# Altium schematic sheet MB_clocking.SchDoc
size A
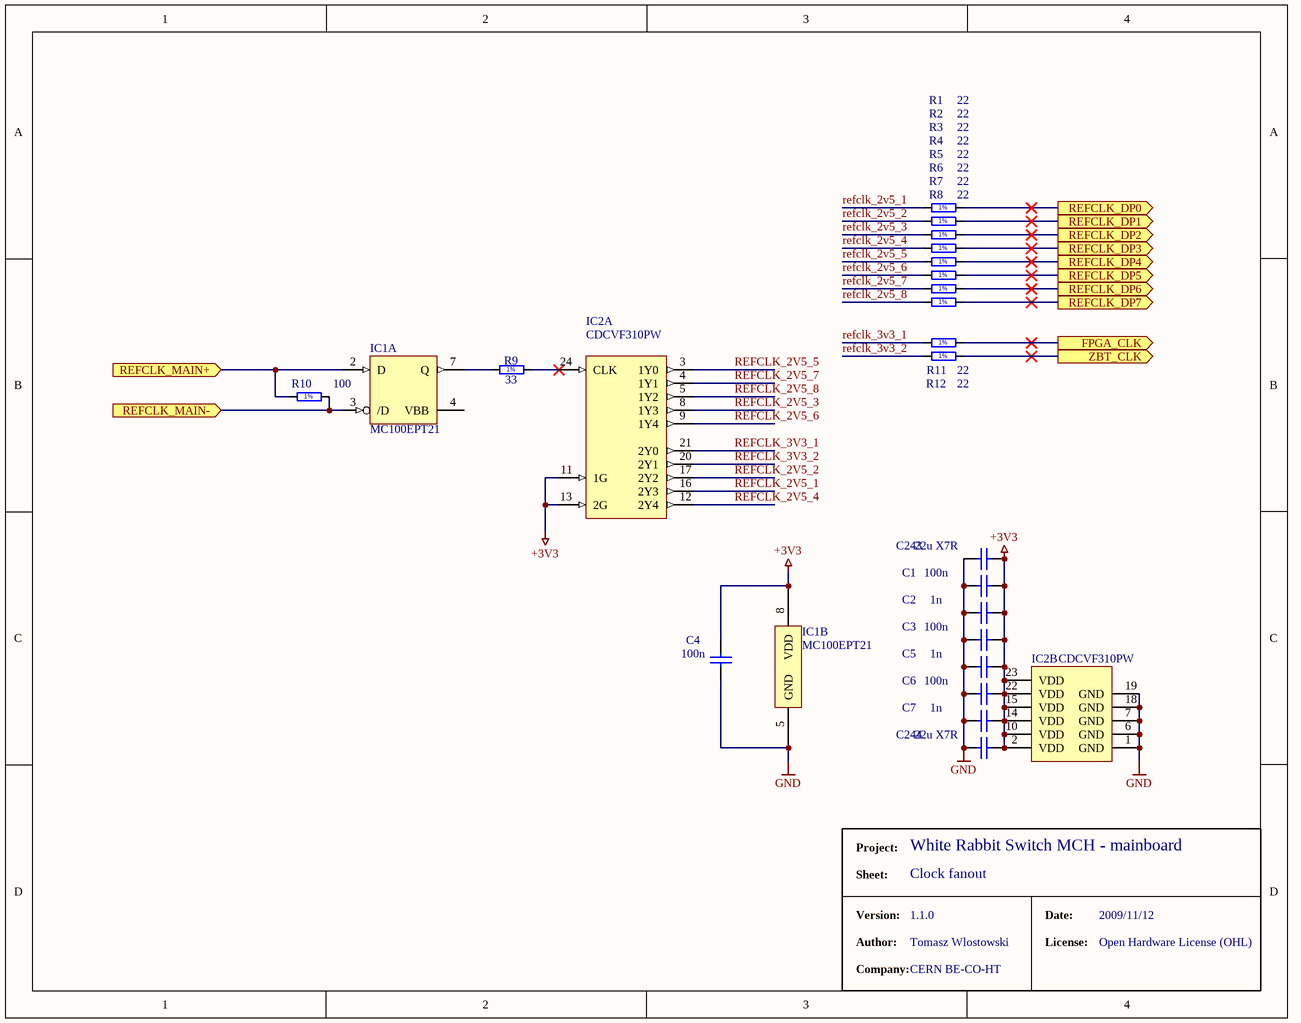
[diagram p0: MB_clocking.SchDoc]

## Parts
C1  100n  [CAPC1005X55N]
C2  1n  [CAPC1005X55N]
C3  100n  [CAPC1005X55N]
C4  100n  [CAPC1005X55N]
C5  1n  [CAPC1005X55N]
C6  100n  [CAPC1005X55N]
C7  1n  [CAPC1005X55N]
C243  22u X7R  [CAPC2012X135N]
C244  22u X7R  [CAPC2012X135N]
IC1  MC100EPT21  [TSOP65P490-8AN]  (parts A,B of 2)
IC2  CDCVF310PW  [TSOP65P640-24AL]  (parts A,B of 2)
R1  22  [RESC1005X40N]
R2  22  [RESC1005X40N]
R3  22  [RESC1005X40N]
R4  22  [RESC1005X40N]
R5  22  [RESC1005X40N]
R6  22  [RESC1005X40N]
R7  22  [RESC1005X40N]
R8  22  [RESC1005X40N]
R9  33  [RESC1005X40N]
R10  100  [RESC1005X40N]
R11  22  [RESC1005X40N]
R12  22  [RESC1005X40N]

## Ports
FPGA_CLK (out), REFCLK_DP0 (out), REFCLK_DP1 (out), REFCLK_DP2 (out), REFCLK_DP3 (out), REFCLK_DP4 (out), REFCLK_DP5 (out), REFCLK_DP6 (out), REFCLK_DP7 (out), REFCLK_MAIN+ (in), REFCLK_MAIN- (in), ZBT_CLK (out)

## Nets
+3V3: C1.1 C2.2 C3.1 C4.2 C5.2 C6.1 C7.2 C243.1 C244.1 IC1.8(VDD) IC2.2(VDD) IC2.10(VDD) IC2.11(1G) IC2.13(2G) IC2.14(VDD) IC2.15(VDD) IC2.22(VDD) IC2.23(VDD)
GND: C1.2 C2.1 C3.2 C4.1 C5.1 C6.2 C7.1 C243.2 C244.2 IC1.5(GND) IC2.1(GND) IC2.6(GND) IC2.7(GND) IC2.18(GND) IC2.19(GND)
FPGA_CLK: R11.2 ; port FPGA_CLK
refclk_2v5_1: IC2.16(2Y3) R1.1
refclk_2v5_2: IC2.17(2Y2) R2.1
refclk_2v5_3: IC2.8(1Y3) R3.1
refclk_2v5_4: IC2.12(2Y4) R4.1
refclk_2v5_5: IC2.3(1Y0) R5.1
refclk_2v5_6: IC2.9(1Y4) R6.1
refclk_2v5_7: IC2.4(1Y1) R7.1
refclk_2v5_8: IC2.5(1Y2) R8.1
refclk_3v3_1: IC2.21(2Y0) R11.1
refclk_3v3_2: IC2.20(2Y1) R12.1
REFCLK_DP0: R1.2 ; port REFCLK_DP0
REFCLK_DP1: R2.2 ; port REFCLK_DP1
REFCLK_DP2: R3.2 ; port REFCLK_DP2
REFCLK_DP3: R4.2 ; port REFCLK_DP3
REFCLK_DP4: R5.2 ; port REFCLK_DP4
REFCLK_DP5: R6.2 ; port REFCLK_DP5
REFCLK_DP6: R7.2 ; port REFCLK_DP6
REFCLK_DP7: R8.2 ; port REFCLK_DP7
REFCLK_MAIN+: IC1.2(D) R10.1 ; port REFCLK_MAIN+
REFCLK_MAIN-: IC1.3(/D) R10.2 ; port REFCLK_MAIN-
ZBT_CLK: R12.2 ; port ZBT_CLK
NetIC1_7: IC1.7(Q) R9.1
NetIC2_24: IC2.24(CLK) R9.2

Not connected (* = marked no-connect by the designer): IC1 4(VBB)

## Notes on the sheet
- Project:
- Sheet:
- Clock fanout
- White Rabbit Switch MCH - mainboard
- Version:
- Author:
- Company:
- 1.1.0
- Tomasz Wlostowski
- CERN BE-CO-HT
- Date:
- License:
- 2009/11/12
- Open Hardware License (OHL)
- (in symbol R0402_22R_1%_0.0625W_100PPM) 1%
- (in symbol R0402_33R_1%_0.0625W_100PPM) 1%
- (in symbol R0402_100R_1%_0.0625W_100PPM) 1%

## Library data of the parts
C1 C3 C4 C6 = CC0402_100NF_16V_10%_X7R: Non-polarised capacitor; Part Description: SMD Multilayer Chip Ceramic Capacitor; Manufacturer: GENERIC; Manufacturer1 Part Number: 223878715649; Manufacturer1 Datasheet: \\cern.ch\dfs\Applications\Altium\Datasheets\CC0402_X7R_PHYCOMP.pdf; Value: 100nF; Voltage: 16V; TC: X7R; Tolerance: ±10%; Table: Capacitors SMD; Part Number: CC0402_100NF_16V_10%_X7R; Component Kind: Standard; Component Type: Standard; Designator: Capacitor - non polarized; Library Reference: Capacitor - non polarized; Pin Count: 2; Status: Not Recommended; Manufacturer Part Number: CC0402_100NF_16V_10%_X7R; Case: 0402; Mounted: Yes; Socket: No; SMD: Yes; Manufacturer1 Example: PHYCOMP; Manufacturer1 ComponentHeight: 0.55mm; HelpURL: \\cern.ch\dfs\Applications\Altium\Datasheets\CC0402_X7R_PHYCOMP.pdf; Author: CERN DEM JLC; CreateDate: 12/3/2007; LatestRevisionDate: 12/3/2007
C2 C5 C7 = CC0402_1NF_50V_10%_X7R: Non-polarised capacitor; Part Description: SMD Multilayer Chip Ceramic Capacitor; Manufacturer: GENERIC; Manufacturer1 Part Number: 223858715623; Manufacturer1 Datasheet: \\cern.ch\dfs\Applications\Altium\Datasheets\CC0402_X7R_PHYCOMP.pdf; Value: 1nF; Voltage: 50V; TC: X7R; Tolerance: ±10%; Table: Capacitors SMD; Part Number: CC0402_1NF_50V_10%_X7R; Component Kind: Standard; Component Type: Standard; Designator: Capacitor - non polarized; Library Reference: Capacitor - non polarized; Pin Count: 2; Status: Not Recommended; Manufacturer Part Number: CC0402_1NF_50V_10%_X7R; Case: 0402; Mounted: Yes; Socket: No; SMD: Yes; Manufacturer1 Example: PHYCOMP; Manufacturer1 ComponentHeight: 0.55mm; HelpURL: \\cern.ch\dfs\Applications\Altium\Datasheets\CC0402_X7R_PHYCOMP.pdf; Author: CERN DEM JLC; CreateDate: 2007-12-03; LatestRevisionDate: 2007-12-03
C243 C244 = CC0805_22uF_6.3V_20%_X5R: Non-polarised capacitor; Part Description: SMD Multilayer Chip Ceramic Capacitor; Manufacturer: GENERIC; Manufacturer1 Part Number: C0805C226M9PAC7800; Manufacturer1 Datasheet: \\cern.ch\dfs\Applications\Altium\Datasheets\CC1206_X5R_KEMET.pdf; Value: 22uF; Voltage: 6.3V; TC: X5R; Tolerance: ±20%; Table: Capacitors SMD; Part Number: CC0805_22uF_6.3V_20%_X5R; Component Kind: Standard; Component Type: Standard; Designator: Capacitor - non polarized; Library Reference: Capacitor - non polarized; Pin Count: 2; Status: Preferred; Manufacturer Part Number: CC0805_22uF_6.3V_20%_X5R; Case: 0805; Mounted: Yes; Socket: No; SMD: Yes; Manufacturer1 Example: KEMET; Manufacturer1 ComponentHeight: 1.45mm; HelpURL: \\cern.ch\dfs\Applications\Altium\Datasheets\CC1206_X5R_KEMET.pdf; Author: CERN DEM JLC; CreateDate: 12/3/2007; LatestRevisionDate: 12/3/2007
IC1 = MC100EPT21: ONSemi LVDS/LVPECL -> LVTTL/LVCMOS buffer; RefId: MC100EPT21DTGOS-ND; Supplier: Digikey; Value: MC100EPT21
IC2 = CDCVF310: 1:10 LVTTL/LVCMOS clock fanout
R1-R8 R11 R12 = R0402_22R_1%_0.0625W_100PPM: Resistor - 1%; Part Description: General Purpose Thick Film Chip Resistor; Manufacturer: GENERIC; Manufacturer1 Part Number: 232270672209; Manufacturer1 Datasheet: \\cern.ch\dfs\Applications\Altium\Datasheets\R0402_Phycomp_RC0402.pdf; TC: ±100ppm/°C; Table: Resistors SMD; Part Number: R0402_22R_1%_0.0625W_100PPM; Component Kind: Standard; Component Type: Standard; Designator: Resistor - 1%; Library Reference: Resistor - 1%; Pin Count: 2; Value: 22; Status: Not recommended; Power: 0.0625W; Tolerance: ±1%; Manufacturer Part Number: R0402_22R_1%_0.0625W_100PPM; Case: 0402; Mounted: Yes; Socket: No; SMD: Yes; Manufacturer1 Example: PHYCOMP; Manufacturer1 ComponentHeight: 0.4mm; HelpURL: \\cern.ch\dfs\Applications\Altium\Datasheets\R0402_Phycomp_RC0402.pdf; Author: CERN DEM JLC; CreateDate: 12/3/2007; LatestRevisionDate: 3/13/2008
R9 = R0402_33R_1%_0.0625W_100PPM: Resistor - 1%; Part Description: General Purpose Thick Film Chip Resistor; Manufacturer: GENERIC; Manufacturer1 Part Number: 232270673309; Manufacturer1 Datasheet: \\cern.ch\dfs\Applications\Altium\Datasheets\R0402_Phycomp_RC0402.pdf; TC: ±100ppm/°C; Table: Resistors SMD; Part Number: R0402_33R_1%_0.0625W_100PPM; Component Kind: Standard; Component Type: Standard; Designator: Resistor - 1%; Library Reference: Resistor - 1%; Pin Count: 2; Value: 33; Status: Not recommended; Power: 0.0625W; Tolerance: ±1%; Manufacturer Part Number: R0402_33R_1%_0.0625W_100PPM; Case: 0402; Mounted: Yes; Socket: No; SMD: Yes; Manufacturer1 Example: PHYCOMP; Manufacturer1 ComponentHeight: 0.4mm; HelpURL: \\cern.ch\dfs\Applications\Altium\Datasheets\R0402_Phycomp_RC0402.pdf; Author: CERN DEM JLC; CreateDate: 12/3/2007; LatestRevisionDate: 3/13/2008
R10 = R0402_100R_1%_0.0625W_100PPM: Resistor - 1%; Part Description: General Purpose Thick Film Chip Resistor; Manufacturer: GENERIC; Manufacturer1 Part Number: 232270671001; Manufacturer1 Datasheet: \\cern.ch\dfs\Applications\Altium\Datasheets\R0402_Phycomp_RC0402.pdf; TC: ±100ppm/°C; Table: Resistors SMD; Part Number: R0402_100R_1%_0.0625W_100PPM; Component Kind: Standard; Component Type: Standard; Designator: Resistor - 1%; Library Reference: Resistor - 1%; Pin Count: 2; Value: 100; Status: Not recommended; Power: 0.0625W; Tolerance: ±1%; Manufacturer Part Number: R0402_100R_1%_0.0625W_100PPM; Case: 0402; Mounted: Yes; Socket: No; SMD: Yes; Manufacturer1 Example: PHYCOMP; Manufacturer1 ComponentHeight: 0.4mm; HelpURL: \\cern.ch\dfs\Applications\Altium\Datasheets\R0402_Phycomp_RC0402.pdf; Author: CERN DEM JLC; CreateDate: 12/3/2007; LatestRevisionDate: 3/13/2008